# Altium schematic sheet msp430最小系统.SchDoc
size A3
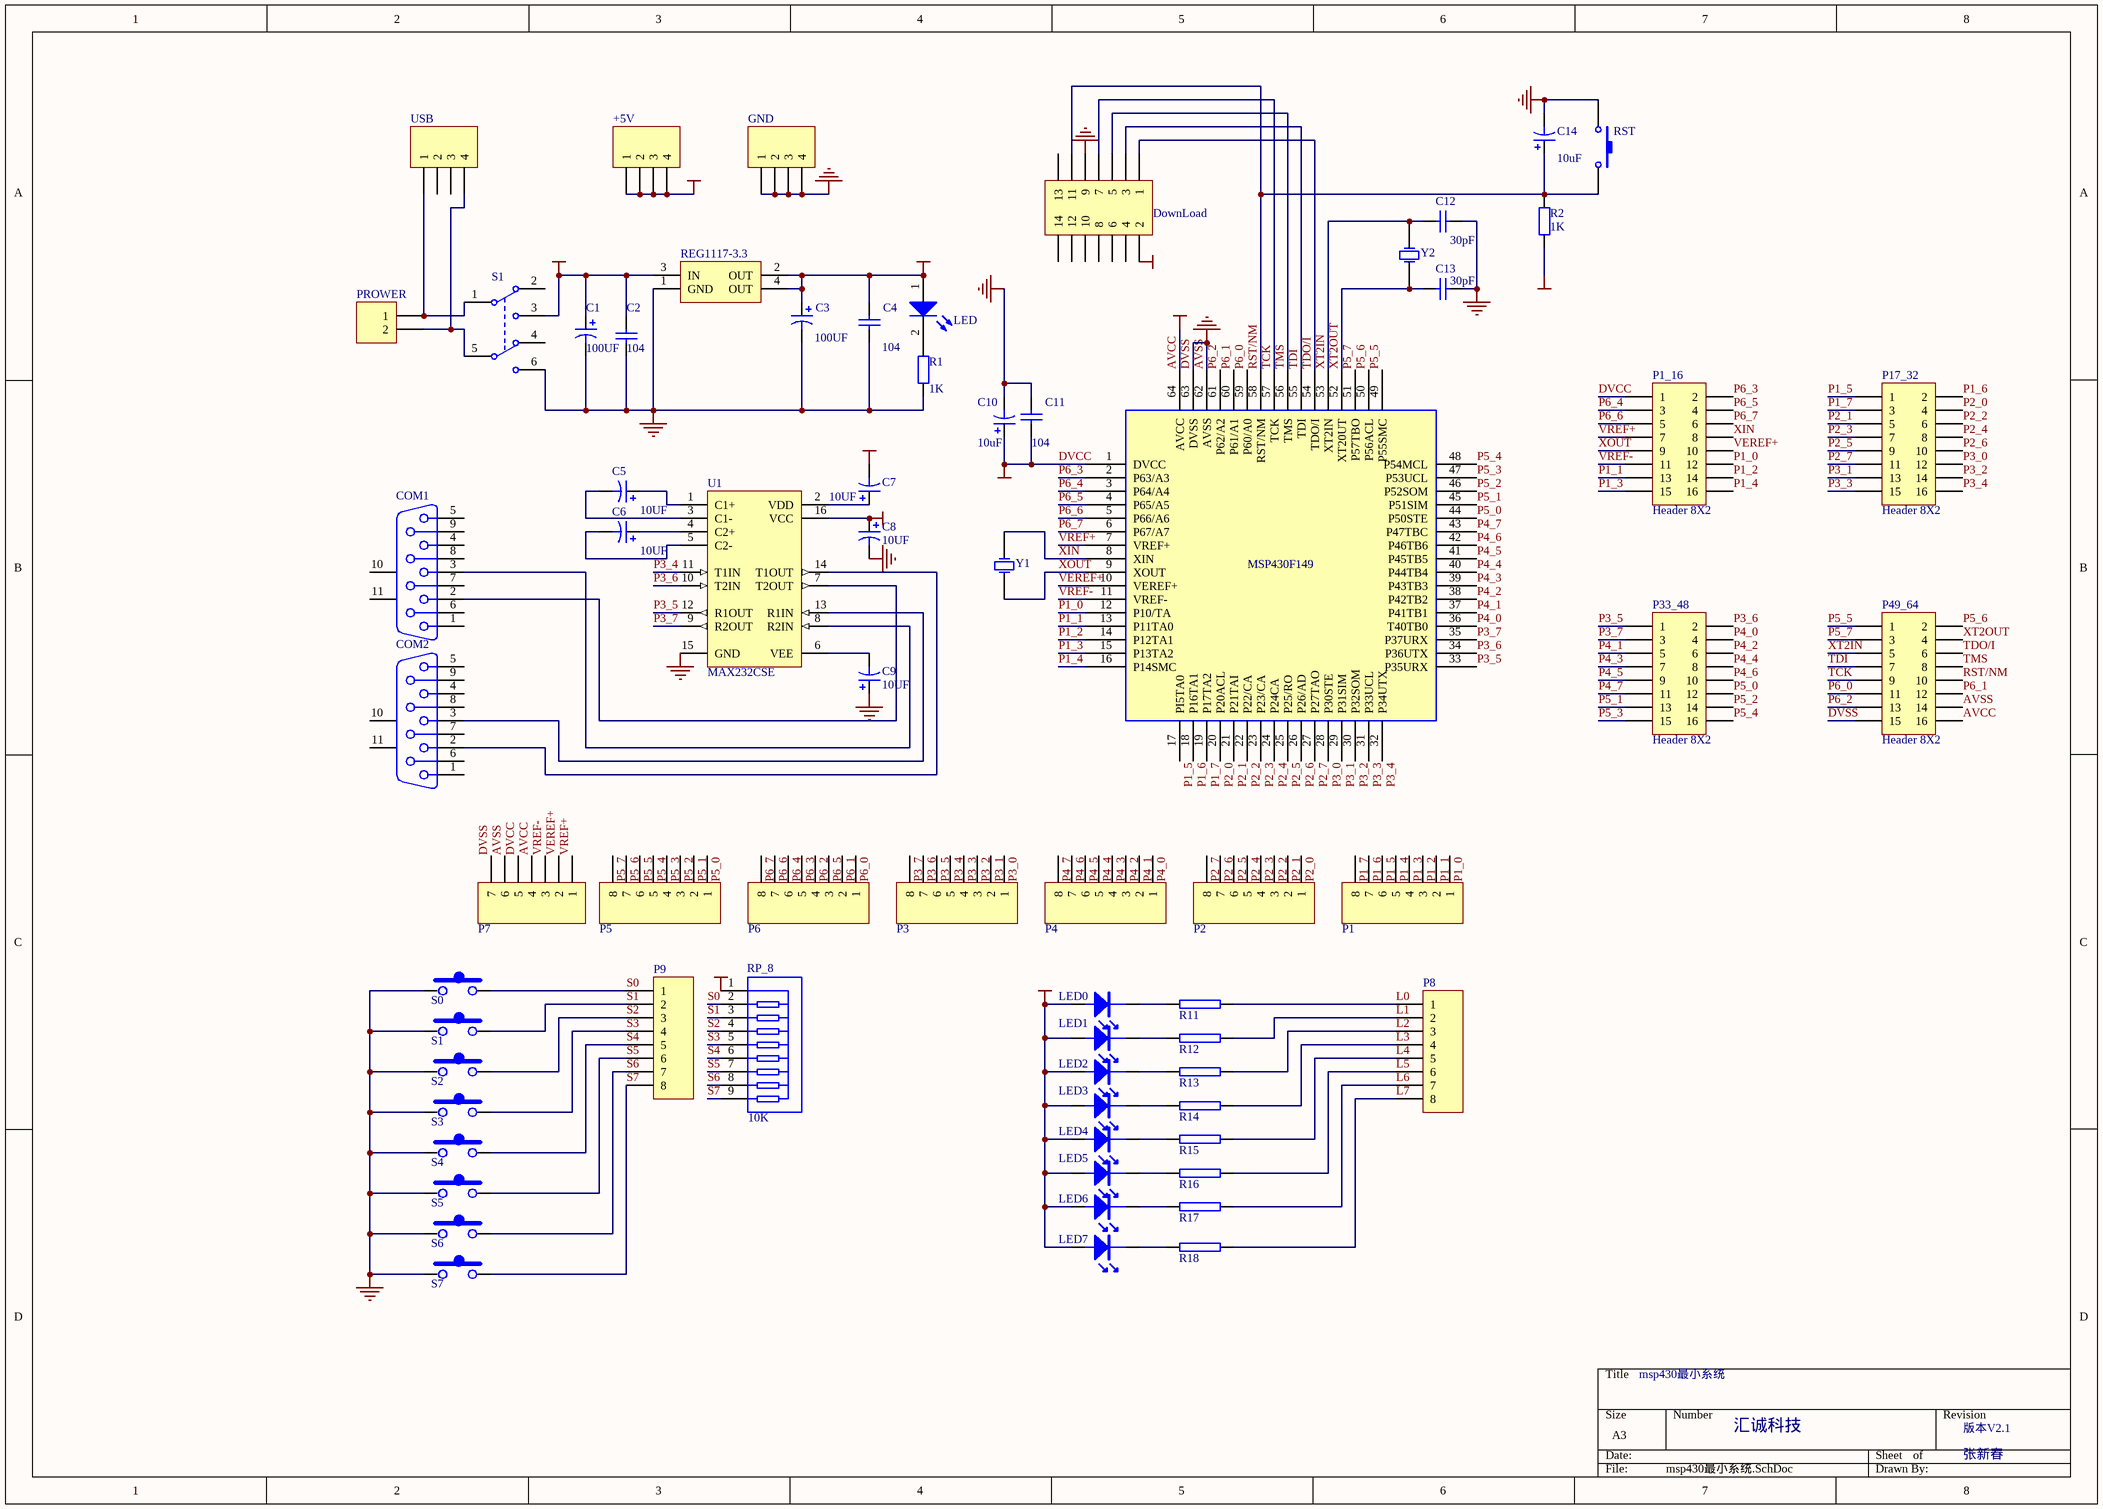
[diagram p0: msp430最小系统.SchDoc]

## Parts
1  S0  [an-6*6]
2  S1  [an-6*6]
3  S2  [an-6*6]
4  S3  [an-6*6]
5  S4  [an-6*6]
6  S5  [an-6*6]
7  S6  [an-6*6]
8  S7  [an-6*6]
+5V  Header 4  [HDR1X4]  (value not drawn)
C1  value 100UF  [C-DJ-6]  (hidden comment: Cap Pol1)
C2  value 104  [CPDR]  (hidden comment: Cap Semi)
C3  value 100UF  [C-DJ-4]  (hidden comment: Cap Pol1)
C4  value 104  [CPDR]  (hidden comment: Cap Semi)
C5  value 10UF  [C-DJ-4]  (hidden comment: Cap Pol1)
C6  value 10UF  [C-DJ-4]  (hidden comment: Cap Pol1)
C7  value 10UF  [C-DJ-4]  (hidden comment: Cap Pol1)
C8  value 10UF  [C-DJ-4]  (hidden comment: Cap Pol1)
C9  value 10UF  [C-DJ-4]  (hidden comment: Cap Pol1)
C10  value 10uF  [C-DJ-4]  (hidden comment: Cap Pol1)
C11  value 104  [CPDR]  (hidden comment: Cap Semi)
C12  value 30pF  [CPDR]  (hidden comment: CPDR)
C13  value 30pF  [CPDR]  (hidden comment: CPDR)
C14  value 10uF  [C-DJ-4]  (hidden comment: Cap Pol1)
COM1  D Connector 9  [COM-9]  (value not drawn)
COM2  D Connector 9  [COM-9]  (value not drawn)
DownLoad  Header 7X2  [HDR-2X7]  (value not drawn)
DS1  LED  [LED]
GND  Header 4  [HDR1X4]  (value not drawn)
LED0  LED  [TP-0805-D]  (value not drawn)
LED1  LED  [TP-0805-D]  (value not drawn)
LED2  LED  [TP-0805-D]  (value not drawn)
LED3  LED  [TP-0805-D]  (value not drawn)
LED4  LED  [TP-0805-D]  (value not drawn)
LED5  LED  [TP-0805-D]  (value not drawn)
LED6  LED  [TP-0805-D]  (value not drawn)
LED7  LED  [TP-0805-D]  (value not drawn)
MSP430F149  MSP430F149  [MPS430149]
P1  Header 8  [HDR-8]  (value not drawn)
P1_16  Header 8X2  [HDR2X8]
P2  Header 8  [HD-8]  (value not drawn)
P3  Header 8  [HD-8]  (value not drawn)
P4  Header 8  [HD-8]  (value not drawn)
P5  Header 8  [HD-8]  (value not drawn)
P6  Header 8  [HD-8]  (value not drawn)
P7  Header 7  [HDR1X7]  (value not drawn)
P8  PZ_8  [HDR-8]  (value not drawn)
P9  PZ_8  [HDR-8]  (value not drawn)
P17_32  Header 8X2  [HDR2X8]
P33_48  Header 8X2  [HDR2X8]
P49_64  Header 8X2  [HDR2X8]
PROWER  PZ_2  [JK128_2]  (value not drawn)
R1  value 1K  [TP-0805-R]  (hidden comment: Res)
R2  value 1K  [TP-0805-R]  (hidden comment: Res)
R11  RES1  [TP-0805-R]  (value not drawn)
R12  RES1  [TP-0805-R]  (value not drawn)
R13  RES1  [TP-0805-R]  (value not drawn)
R14  RES1  [TP-0805-R]  (value not drawn)
R15  RES1  [TP-0805-R]  (value not drawn)
R16  RES1  [TP-0805-R]  (value not drawn)
R17  RES1  [TP-0805-R]  (value not drawn)
R18  RES1  [TP-0805-R]  (value not drawn)
REG1117-3.3  REG1117-3.3  [ZZ311]  (value not drawn)
RP_8  value 10K  [HDR-10]  (hidden comment: Res PZ_8)
RST  AJKG  [an-6*6]  (value not drawn)
S1  ZSKG_KEY  [DPDT-6]  (value not drawn)
U1  MAX232CSE  [DIP-16]
USB  PZ_4  [USB-5V]  (value not drawn)
Y1  XTAL  [BCY-W2/D3.1]  (value not drawn)
Y2  XTAL  [JZ_ZC]  (value not drawn)

## Nets
+5V: +5V.1 +5V.2 +5V.3 +5V.4 C1.1 C2.2 C7.2 C8.1 REG1117-3.3.3(IN) S1.3(NO1) U1.16(VCC)
AVCC: C3.1 C4.2 C10.1 C11.1 DownLoad.2 DS1.1(A) LED0.1(A) LED1.1(A) LED2.1(A) LED3.1(A) LED4.1(A) LED5.1(A) LED6.1(A) LED7.1(A) MSP430F149.1(DVCC) MSP430F149.64(AVCC) P1_16.1 P7.4 P7.5 P49_64.16 R2.1 REG1117-3.3.2(OUT) REG1117-3.3.4(OUT) RP_8.1  [also labelled DVCC, VCC]
AVSS: 1.1 2.1 3.1 4.1 5.1 6.1 7.1 8.1 C1.2 C2.1 C3.2 C4.1 C8.2 C9.1 C10.2 C11.2 C12.2 C13.2 C14.2 DownLoad.9 GND.1 GND.2 GND.3 GND.4 MSP430F149.62(AVSS) MSP430F149.63(DVSS) P7.6 P7.7 P49_64.14 P49_64.15 R1.1 REG1117-3.3.1(GND) RST.1 S1.6(NO2) U1.15(GND)  [also labelled DVSS, GND]
L0: P8.1 R11.1
L1: P8.2 R12.1
L2: P8.3 R13.1
L3: P8.4 R14.1
L4: P8.5 R15.1
L5: P8.6 R16.1
L6: P8.7 R17.1
L7: P8.8 R18.1
P1_0: MSP430F149.12(P10/TA) P1.1 P1_16.12
P1_1: MSP430F149.13(P11TA0) P1.2 P1_16.13
P1_2: MSP430F149.14(P12TA1) P1.3 P1_16.14
P1_3: MSP430F149.15(P13TA2) P1.4 P1_16.15
P1_4: MSP430F149.16(P14SMC) P1.5 P1_16.16
P1_5: MSP430F149.17(PI5TA0) P1.6 P17_32.1
P1_6: MSP430F149.18(P16TA1) P1.7 P17_32.2
P1_7: MSP430F149.19(P17TA2) P1.8 P17_32.3
P2_0: MSP430F149.20(P20ACL) P2.1 P17_32.4
P2_1: MSP430F149.21(P21TAI) P2.2 P17_32.5
P2_2: MSP430F149.22(P22/CA) P2.3 P17_32.6
P2_3: MSP430F149.23(P23/CA) P2.4 P17_32.7
P2_4: MSP430F149.24(P24CA) P2.5 P17_32.8
P2_5: MSP430F149.25(P25/RO) P2.6 P17_32.9
P2_6: MSP430F149.26(P26/AD) P2.7 P17_32.10
P2_7: MSP430F149.27(P27TAO) P2.8 P17_32.11
P3_0: MSP430F149.28(P30STE) P3.1 P17_32.12
P3_1: MSP430F149.29(P31SIM) P3.2 P17_32.13
P3_2: MSP430F149.30(P32SOM) P3.3 P17_32.14
P3_3: MSP430F149.31(P33UCL) P3.4 P17_32.15
P3_4: MSP430F149.32(P34UTX) P3.5 P17_32.16 U1.11(T1IN)
P3_5: MSP430F149.33(P35URX) P3.6 P33_48.1 U1.12(R1OUT)
P3_6: MSP430F149.34(P36UTX) P3.7 P33_48.2 U1.10(T2IN)
P3_7: MSP430F149.35(P37URX) P3.8 P33_48.3 U1.9(R2OUT)
P4_0: MSP430F149.36(T40TB0) P4.1 P33_48.4
P4_1: MSP430F149.37(P41TB1) P4.2 P33_48.5
P4_2: MSP430F149.38(P42TB2) P4.3 P33_48.6
P4_3: MSP430F149.39(P43TB3) P4.4 P33_48.7
P4_4: MSP430F149.40(P44TB4) P4.5 P33_48.8
P4_5: MSP430F149.41(P45TB5) P4.6 P33_48.9
P4_6: MSP430F149.42(P46TB6) P4.7 P33_48.10
P4_7: MSP430F149.43(P47TBC) P4.8 P33_48.11
P5_0: MSP430F149.44(P50STE) P5.1 P33_48.12
P5_1: MSP430F149.45(P51SIM) P5.2 P33_48.13
P5_2: MSP430F149.46(P52SOM) P5.3 P33_48.14
P5_3: MSP430F149.47(P53UCL) P5.4 P33_48.15
P5_4: MSP430F149.48(P54MCL) P5.5 P33_48.16
P5_5: MSP430F149.49(P55SMC) P5.6 P49_64.1
P5_6: MSP430F149.50(P56ACL) P5.7 P49_64.2
P5_7: MSP430F149.51(P57TBO) P5.8 P49_64.3
P6_0: MSP430F149.59(P60/A0) P6.1 P49_64.11
P6_1: MSP430F149.60(P61/A1) P6.2 P49_64.12
P6_2: MSP430F149.61(P62/A2) P6.4 P49_64.13
P6_3: MSP430F149.2(P63/A3) P1_16.2 P6.5
P6_4: MSP430F149.3(P64/A4) P1_16.3 P6.6
P6_5: MSP430F149.4(P65/A5) P1_16.4 P6.3
P6_6: MSP430F149.5(P66/A6) P1_16.5 P6.7
P6_7: MSP430F149.6(P67/A7) P1_16.6 P6.8
RST/NM: C14.1 DownLoad.11 MSP430F149.58(RST/NM) P49_64.10 R2.2 RST.2
S0: 1.2 P9.1 RP_8.2
S1: 2.2 P9.2 RP_8.3
S2: 3.2 P9.3 RP_8.4
S3: 4.2 P9.4 RP_8.5
S4: 5.2 P9.5 RP_8.6
S5: 6.2 P9.6 RP_8.7
S6: 7.2 P9.7 RP_8.8
S7: 8.2 P9.8 RP_8.9
TCK: DownLoad.7 MSP430F149.57(TCK) P49_64.9
TDI: DownLoad.3 MSP430F149.55(TDI) P49_64.7
TDO/I: DownLoad.1 MSP430F149.54(TDO/I) P49_64.6
TMS: DownLoad.5 MSP430F149.56(TMS) P49_64.8
VEREF+: MSP430F149.10(VEREF+) P1_16.10 P7.2
VREF+: MSP430F149.7(VREF+) P1_16.7 P7.1
VREF-: MSP430F149.11(VREF-) P1_16.11 P7.3
XIN: MSP430F149.8(XIN) P1_16.8 Y1.1(OSC1)
XOUT: MSP430F149.9(XOUT) P1_16.9 Y1.2(OSC2)
XT2IN: C12.1 MSP430F149.53(XT2IN) P49_64.5 Y2.2(OSC2)
XT2OUT: C13.1 MSP430F149.52(XT20UT) P49_64.4 Y2.1(OSC1)
NetC5_1: C5.1 U1.1(C1+)
NetC5_2: C5.2 U1.3(C1-)
NetC6_1: C6.1 U1.4(C2+)
NetC6_2: C6.2 U1.5(C2-)
NetC7_1: C7.1 U1.2(VDD)
NetC9_2: C9.2 U1.6(VEE)
NetCOM1_2: COM1.2 U1.7(T2OUT)
NetCOM1_3: COM1.3 U1.8(R2IN)
NetCOM2_2: COM2.2 U1.14(T1OUT)
NetCOM2_3: COM2.3 U1.13(R1IN)
NetDS1_2: DS1.2(K) R1.2
NetLED0_2: LED0.2(K) R11.2
NetLED1_2: LED1.2(K) R12.2
NetLED2_2: LED2.2(K) R13.2
NetLED3_2: LED3.2(K) R14.2
NetLED4_2: LED4.2(K) R15.2
NetLED5_2: LED5.2(K) R16.2
NetLED6_2: LED6.2(K) R17.2
NetLED7_2: LED7.2(K) R18.2
NetPROWER_1: PROWER.1 S1.1(COMMON1) USB.1
NetPROWER_2: PROWER.2 S1.5(COMMON2) USB.4

Not connected (* = marked no-connect by the designer): COM1 1 4 5 6 7 8 9 10(MH1) 11(MH2); COM2 1 4 5 6 7 8 9 10(MH1) 11(MH2); DownLoad 4 6 8 10 12 13 14; S1 2(NC1) 4(NC2); USB 2 3

## Notes on the sheet
- msp430最小系统
- 汇诚科技
- 张新春
- 版本V2.1

## Library data of the parts
1-8 = KEY
+5V GND = Header 4: Header, 4-Pin; LatestRevisionDate: 17-Jul-2002; LatestRevisionNote: Re-released for DXP Platform.; Publisher: Altium Limited
C1 C3 C5-C10 C14 = Cap Pol1: Polarized Capacitor (Radial); Published: 8-Jun-2000; LatestRevisionDate: 17-Jul-2002; LatestRevisionNote: Re-released for DXP Platform.; Publisher: Altium Limited
C2 C4 C11 = Cap Semi: Capacitor (Semiconductor SIM Model); Published: 8-Jun-2000; LatestRevisionDate: 17-Jul-2002; LatestRevisionNote: Re-released for DXP Platform.; PackageReference: C1206; Publisher: Altium Limited
C12 C13 = CPDR: 瓷片电容; Published: 8-Jun-2000; LatestRevisionDate: 17-Jul-2002; LatestRevisionNote: Re-released for DXP Platform.; Publisher: Altium Limited
COM1 COM2 = D Connector 9: Receptacle Assembly, 9 Position, Right Angle; PackageDocument: O; Positions: 9; Published: 15-Jun-2001; LatestRevisionDate: 17-Jul-2002; LatestRevisionNote: Re-released for DXP Platform.; DatasheetDocument: 1-Sep-1999; PackageReference: 788750; Publisher: Altium Limited; Orientation: Right Angle; Gender: Receptacle
DownLoad = Header 7X2: Header, 7-Pin, Dual row; LatestRevisionDate: 17-Jul-2002; LatestRevisionNote: Re-released for DXP Platform.; Publisher: Altium Limited
DS1 = LED: 发光二极管; Published: 8-Jun-2000; LatestRevisionDate: 17-Jul-2002; LatestRevisionNote: Re-released for DXP Platform.; Publisher: Altium Limited
MSP430F149 = MSP430F133
P1-P6 = Header 8: Header, 8-Pin; LatestRevisionDate: 17-Jul-2002; LatestRevisionNote: Re-released for DXP Platform.; Publisher: Altium Limited
P1_16 P17_32 P33_48 P49_64 = Header 8X2: Header, 8-Pin, Dual row; LatestRevisionDate: 17-Jul-2002; LatestRevisionNote: Re-released for DXP Platform.; Publisher: Altium Limited
P7 = Header 7: Header, 7-Pin; LatestRevisionDate: 17-Jul-2002; LatestRevisionNote: Re-released for DXP Platform.; Publisher: Altium Limited
P8 P9 = PZ_8: 排针——8; LatestRevisionDate: 17-Jul-2002; LatestRevisionNote: Re-released for DXP Platform.; Publisher: Altium Limited
PROWER = PZ_2: 排针——2; LatestRevisionDate: 17-Jul-2002; LatestRevisionNote: Re-released for DXP Platform.; Publisher: Altium Limited
R1 R2 = Res: 电阻; Published: 8-Jun-2000; LatestRevisionDate: 17-Jul-2002; LatestRevisionNote: Re-released for DXP Platform.; Publisher: Altium Limited
REG1117-3.3 = REG1117-3.3: 800mA and 1A Low Dropout Positive Regulator 2.85V, 3.3V, 5V, and Adjustable; PackageDocument: revC; Published: 8-Jun-2000; LatestRevisionDate: 17-Jul-2002; LatestRevisionNote: Re-released for DXP Platform.; DatasheetDocument: Sep-1997; PackageReference: ZZ311; Publisher: Altium Limited
RP_8 = Res PZ_8: 8位排阻; Published: 24-Mar-1999; LatestRevisionDate: 17-Jul-2002; LatestRevisionNote: Re-released for DXP Platform.; Publisher: Altium Limited; Code_JEDEC: MO-150-AC
RST = AJKG: 按键开关; Published: 24-Mar-1999; LatestRevisionDate: 17-Jul-2002; LatestRevisionNote: Re-released for DXP Platform.; Publisher: Altium Limited
S1 = ZSKG_KEY: 自锁开关; Published: 24-Mar-1999; LatestRevisionDate: 17-Jul-2002; LatestRevisionNote: Re-released for DXP Platform.; Publisher: Altium Limited
U1 = MAX232CSE: +5V Powered, Multi-Channel RS-232 Driver/Receiver; Code - JEDEC: MS-012-AC; Code - IPC: SO16; Published: 16-Jan-2001; Revision: 17-Jul-2002: Re-released for DXP Platform.; Package Reference: NSO16; Publisher: Altium Limited
USB = PZ_4: 排针——4; LatestRevisionDate: 17-Jul-2002; LatestRevisionNote: Re-released for DXP Platform.; Publisher: Altium Limited
Y1 Y2 = XTAL: Crystal Oscillator; Published: 8-Jun-2000; LatestRevisionDate: 17-Jul-2002; LatestRevisionNote: Re-released for DXP Platform.; Publisher: Altium Limited